# Altium schematic sheet rtc.SchDoc: Control Plane
size Letter; Author: Ye-Sheng Kuo; Revision: 2; SheetNumber: 8; SheetTotal: 8
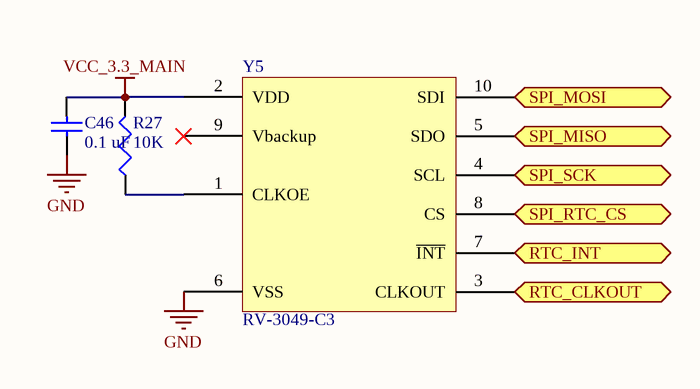
[diagram p0: rtc.SchDoc]

## Parts
C46  value 0.1 uF  [0402]  (hidden comment: Ceramic capacitor)
R27  value 10K  [0402]  (hidden comment: Chip resistor)
Y5  RV-3049-C3  [RV-3049-C3]

## Ports
RTC_CLKOUT, RTC_INT, SPI_MISO, SPI_MOSI, SPI_RTC_CS, SPI_SCK

## Nets
GND: C46.2 Y5.6(VSS)
VCC_3.3_MAIN: C46.1 R27.1 Y5.2(VDD)
RTC_CLKOUT: Y5.3(CLKOUT) ; port RTC_CLKOUT
RTC_INT: Y5.7(~{INT}) ; port RTC_INT
SPI_MISO: Y5.5(SDO) ; port SPI_MISO
SPI_MOSI: Y5.10(SDI) ; port SPI_MOSI
SPI_RTC_CS: Y5.8(CS) ; port SPI_RTC_CS
SPI_SCK: Y5.4(SCL) ; port SPI_SCK
NetR27_2: R27.2 Y5.1(CLKOE)

Not connected (* = marked no-connect by the designer): Y5 9(Vbackup)*

## Notes on the sheet
- Title
- Date:
- Author:
- Revision:
- Sheet
- of
- University of Michigan
- File:

## Library data of the parts
C46 = C_0.1u_10V_0402_ceramic: Ceramic capacitor, 0.1u, 0402 package; Manufacture: TDK; voltage rated: 10 V; tolerance: 10%; Supplier 1: Digi-Key; Supplier Part Number 1: 445-1265-1-ND; package: 0402
R27 = R_10K_0402: Chip resistor, 10K, 0402 package; tolerance: 1%; power: 1/16 W; Supplier 1: Digi-Key; Supplier Part Number 1: 541-10.0KLDKR-ND; package: 0402
Y5 = RV-3049-C3: Real Time Clock Module with SPI-Bus